# EAGLE design RTI-Dome-Shutter-RP2040 (EAGLE 9.6.2)
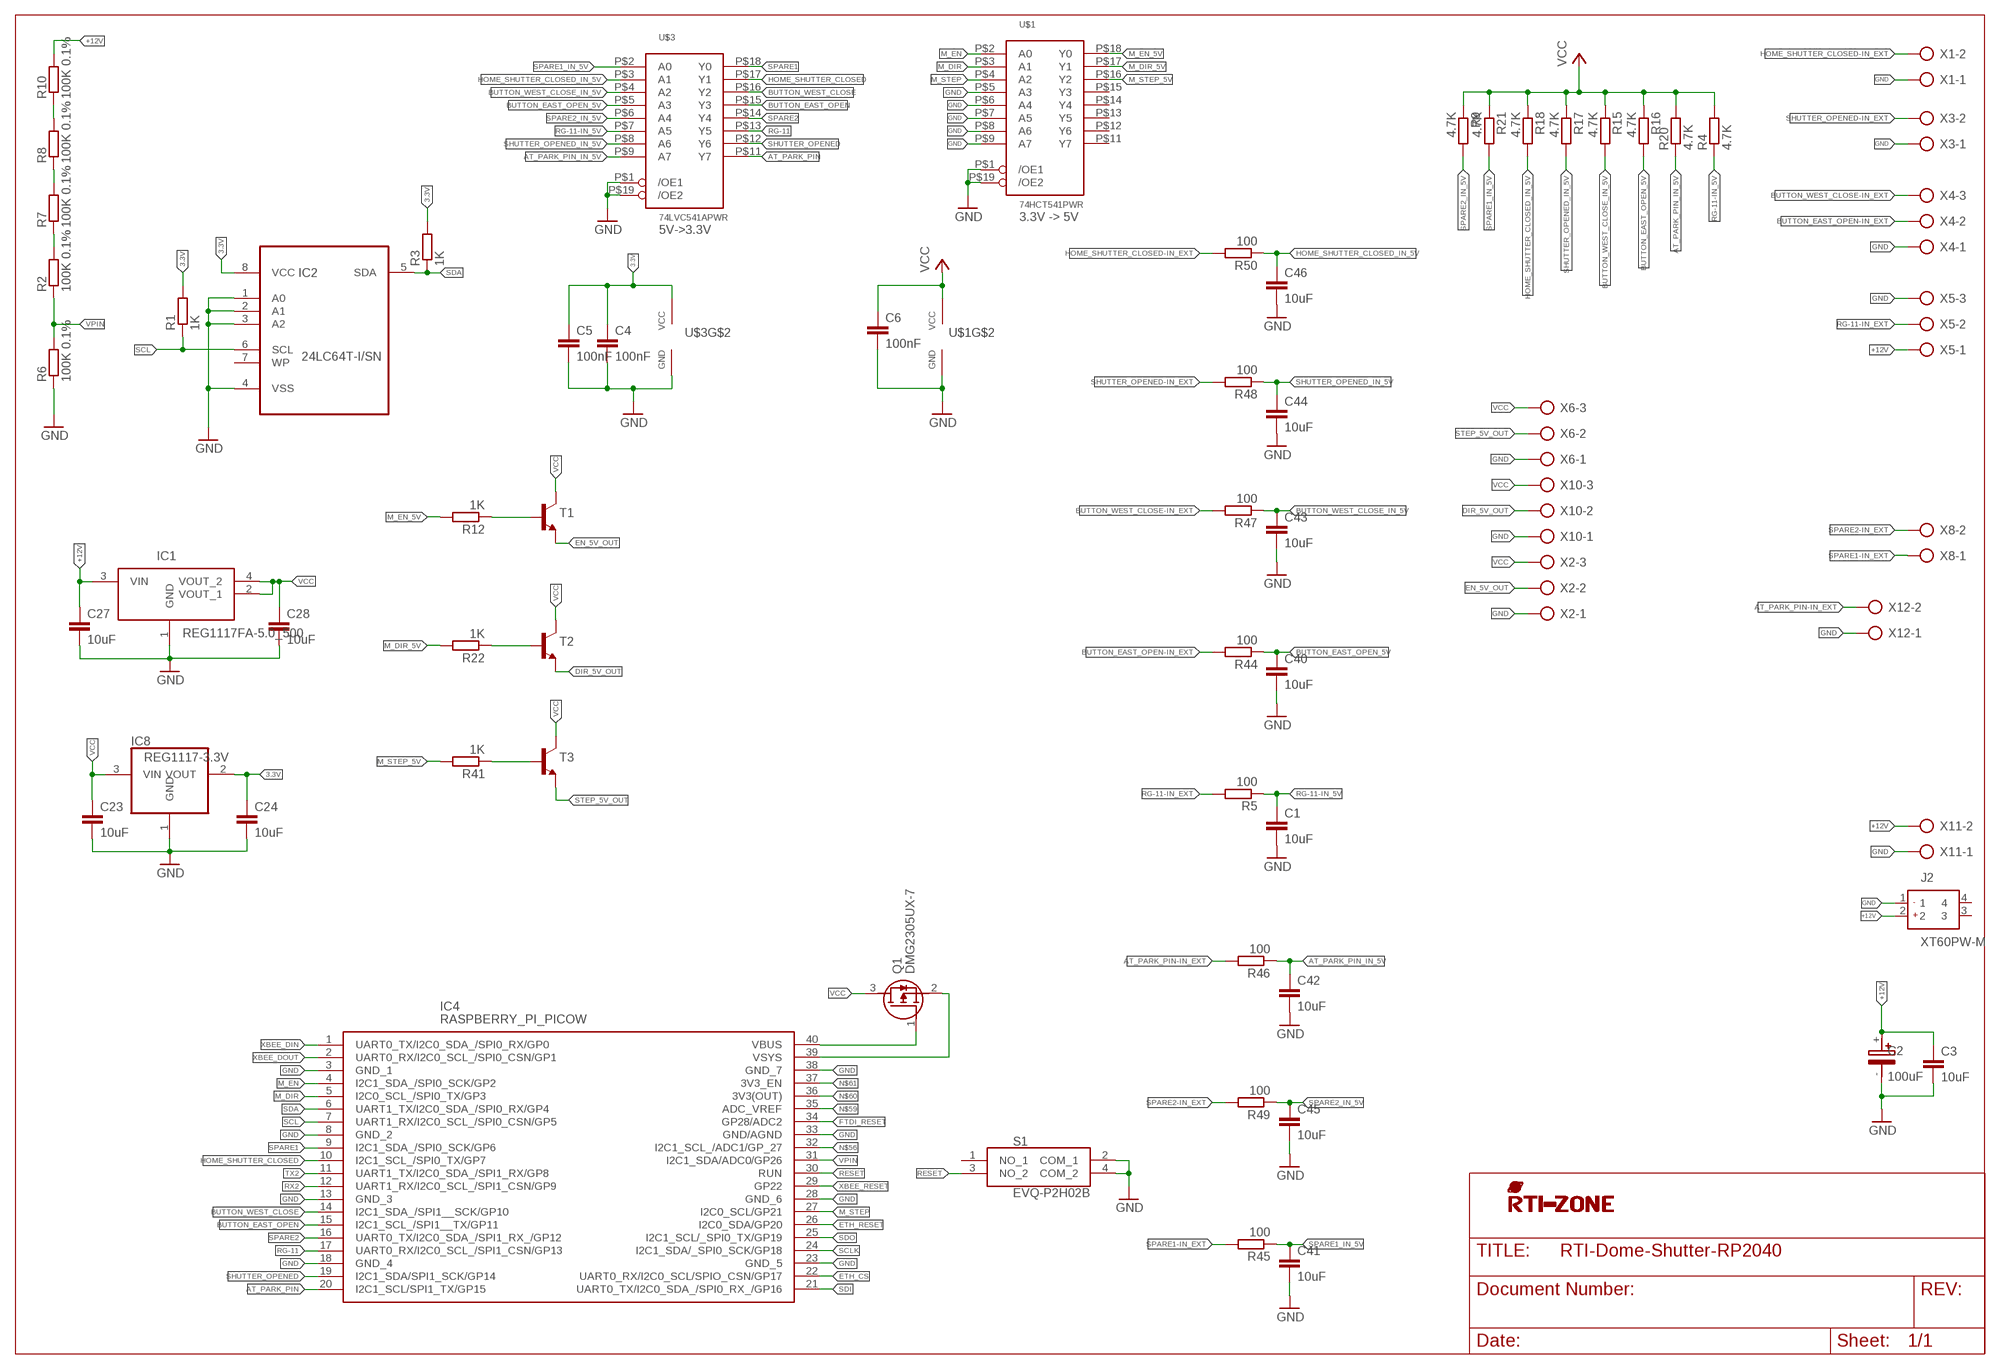
[diagram p0: schematic, sheet 1]

## Parts
C1  10uF  C-EU'0603'  [C0603]
C2  100uF  MAL215099804E3""  [UD-10X10_NICHICON]
C3  10uF  C-EU'0603'  [C0603]
C4  100nF  C-EU'0603'  [C0603]
C5  100nF  C-EU'0603'  [C0603]
C6  100nF  C-EU'0603'  [C0603]
C23  10uF  C-EU'0603'  [C0603]
C24  10uF  C-EU'0603'  [C0603]
C27  10uF  C-EU'0603'  [C0603]
C28  10uF  C-EU'0603'  [C0603]
C40  10uF  C-EU'0603'  [C0603]
C41  10uF  C-EU'0603'  [C0603]
C42  10uF  C-EU'0603'  [C0603]
C43  10uF  C-EU'0603'  [C0603]
C44  10uF  C-EU'0603'  [C0603]
C45  10uF  C-EU'0603'  [C0603]
C46  10uF  C-EU'0603'  [C0603]
IC1  REG1117FA-5.0_500  [REG1117FA50500]
IC2  24LC64T-I/SN  [SOIC127P600X175-8N]
IC4  RASPBERRY_PI_PICOW  [RASPBERRYPIPICO-W]
IC8  REG1117-3.3V  REG1117  [SOT223]
J2  XT60PW-M  [XT60PWM]
Q1  DMG2305UX-7  [SOT96P240X115-3N]
R1  1K  R-EU'0603'  [R0603]
R2  100K 0.1%  R-EU'0603'  [R0603]
R3  1K  R-EU'0603'  [R0603]
R4  4.7K  R-EU'0603'  [R0603]
R5  100  R-EU'0603'  [R0603]
R6  100K 0.1%  R-EU'0603'  [R0603]
R7  100K 0.1%  R-EU'0603'  [R0603]
R8  100K 0.1%  R-EU'0603'  [R0603]
R9  4.7K  R-EU'0603'  [R0603]
R10  100K 0.1%  R-EU'0603'  [R0603]
R12  1K  R-EU'0603'  [R0603]
R15  4.7K  R-EU'0603'  [R0603]
R16  4.7K  R-EU'0603'  [R0603]
R17  4.7K  R-EU'0603'  [R0603]
R18  4.7K  R-EU'0603'  [R0603]
R20  4.7K  R-EU'0603'  [R0603]
R21  4.7K  R-EU'0603'  [R0603]
R22  1K  R-EU'0603'  [R0603]
R41  1K  R-EU'0603'  [R0603]
R44  100  R-EU'0603'  [R0603]
R45  100  R-EU'0603'  [R0603]
R46  100  R-EU'0603'  [R0603]
R47  100  R-EU'0603'  [R0603]
R48  100  R-EU'0603'  [R0603]
R49  100  R-EU'0603'  [R0603]
R50  100  R-EU'0603'  [R0603]
S1  EVQ-P2H02B  [EVQP2H02B]
T1  MMBT3904LT1-NPN-SOT23-BEC  [SOT23-BEC]
T2  MMBT3904LT1-NPN-SOT23-BEC  [SOT23-BEC]
T3  MMBT3904LT1-NPN-SOT23-BEC  [SOT23-BEC]
U$1  74HCT541PWR  74541B  [TSSOP20]
U$3  74LVC541APWR  74541B  [TSSOP20]
U$4  RTI-LOGO_BIG  [LOGO_BIG]
X1  AK500/2  [AK500/2]
X2  AK500/3  [AK500/3]
X3  AK500/2  [AK500/2]
X4  AK500/3  [AK500/3]
X5  AK500/3  [AK500/3]
X6  AK500/3  [AK500/3]
X8  AK500/2  [AK500/2]
X10  AK500/3  [AK500/3]
X11  AK500/2  [AK500/2]
X12  AK500/2  [AK500/2]

## Nets
3.3V: C4.1 C5.1 C24.1 IC2.8(VCC) IC8.2(VOUT) R1.2 R3.2 U$3.P$20(VCC)
+12V [+12V]: C2.+ C3.1 C27.1 IC1.3(VIN) J2.2 R10.2 X5.1 X11.2
AT_PARK_PIN: IC4.20(I2C1_SCL/SPI1_TX/GP15) U$3.P$11(Y7)
AT_PARK_PIN-IN_EXT: R46.2 X12.2
AT_PARK_PIN_IN_5V: C42.1 R20.1 R46.1 U$3.P$9(A7)
BUTTON_EAST_OPEN: IC4.15(I2C1_SCL_/SPI1__TX/GP11) U$3.P$15(Y3)
BUTTON_EAST_OPEN-IN_EXT: R44.2 X4.2
BUTTON_EAST_OPEN_5V: C40.1 R16.2 R44.1 U$3.P$5(A3)
BUTTON_WEST_CLOSE: IC4.14(I2C1_SDA_/SPI1__SCK/GP10) U$3.P$16(Y2)
BUTTON_WEST_CLOSE-IN_EXT: R47.2 X4.3
BUTTON_WEST_CLOSE_IN_5V: C43.1 R15.2 R47.1 U$3.P$4(A2)
DIR-5V_TR: R22.1 T2.B
DIR_5V_OUT: T2.E X10.2
EN-5V_TR: R12.1 T1.B
EN_5V_OUT: T1.E X2.2
ETH_CS: IC4.22(UART0_RX/I2C0_SCL/SPIO_CSN/GP17)
ETH_RESET: IC4.26(I2C0_SDA/GP20)
FTDI_RESET: IC4.34(GP28/ADC2)
GND [GND]: C1.2 C2.- C3.2 C4.2 C5.2 C6.2 C23.2 C24.2 C27.2 C28.2 C40.2 C41.2 C42.2 C43.2 C44.2 C45.2 C46.2 IC1.1(GND) IC2.1(A0) IC2.2(A1) IC2.3(A2) IC2.4(VSS) IC4.3(GND_1) IC4.8(GND_2) IC4.13(GND_3) IC4.18(GND_4) IC4.23(GND_5) IC4.28(GND_6) IC4.33(GND/AGND) IC4.38(GND_7) IC8.1(GND) J2.1 R6.1 S1.2(COM_1) S1.4(COM_2) U$1.P$1(/OE1) U$1.P$5(A3) U$1.P$6(A4) U$1.P$7(A5) U$1.P$8(A6) U$1.P$9(A7) U$1.P$10(GND) U$1.P$19(/OE2) U$3.P$1(/OE1) U$3.P$10(GND) U$3.P$19(/OE2) X1.1 X2.1 X3.1 X4.1 X5.3 X6.1 X10.1 X11.1 X12.1
HOME_SHUTTER_CLOSED: IC4.10(I2C1_SCL_/SPI0_TX/GP7) U$3.P$17(Y1)
HOME_SHUTTER_CLOSED-IN_EXT: R50.2 X1.2
HOME_SHUTTER_CLOSED_IN_5V: C46.1 R18.2 R50.1 U$3.P$3(A1)
M_DIR: IC4.5(I2C0_SCL_/SPI0_TX/GP3) U$1.P$3(A1)
M_DIR_5V: R22.2 U$1.P$17(Y1)
M_EN: IC4.4(I2C1_SDA_/SPI0_SCK/GP2) U$1.P$2(A0)
M_EN_5V: R12.2 U$1.P$18(Y0)
M_STEP: IC4.27(I2C0_SCL/GP21) U$1.P$4(A2)
M_STEP_5V: R41.2 U$1.P$16(Y2)
N$2: R7.2 R8.1
N$3: R8.2 R10.1
N$5: R2.2 R7.1
N$56: IC4.32(I2C1_SCL_/ADC1/GP_27)
N$59: IC4.35(ADC_VREF)
N$60: IC4.36(3V3(OUT))
N$61: IC4.37(3V3_EN)
RESET: IC4.30(RUN) S1.3(NO_2)
RG-11: IC4.17(UART0_RX/I2C0_SCL_/SPI1_CSN/GP13) U$3.P$13(Y5)
RG-11-IN_5V: C1.1 R4.1 R5.1 U$3.P$7(A5)
RG-11-IN_EXT: R5.2 X5.2
RX2: IC4.12(UART1_RX/I2C0_SCL_/SPI1_CSN/GP9)
SCL: IC2.6(SCL) IC4.7(UART1_RX/I2C0_SCL_/SPI0_CSN/GP5) R1.1
SCLK: IC4.24(I2C1_SDA/_SPI0_SCK/GP18)
SDA: IC2.5(SDA) IC4.6(UART1_TX/I2C0_SDA_/SPI0_RX/GP4) R3.1
SDI: IC4.21(UART0_TX/I2C0_SDA_/SPI0_RX_/GP16)
SDO: IC4.25(I2C1_SCL/_SPI0_TX/GP19)
SHUTTER_OPENED: IC4.19(I2C1_SDA/SPI1_SCK/GP14) U$3.P$12(Y6)
SHUTTER_OPENED-IN_EXT: R48.2 X3.2
SHUTTER_OPENED_IN_5V: C44.1 R17.2 R48.1 U$3.P$8(A6)
SPARE1: IC4.9(I2C1_SDA_/SPI0_SCK/GP6) U$3.P$18(Y0)
SPARE1-IN_EXT: R45.2 X8.1
SPARE1_IN_5V: C41.1 R21.2 R45.1 U$3.P$2(A0)
SPARE2: IC4.16(UART0_TX/I2C0_SDA_/SPI1_RX_/GP12) U$3.P$14(Y4)
SPARE2-IN_EXT [GND]: R49.2 X8.2
SPARE2_IN_5V [GND]: C45.1 R9.2 R49.1 U$3.P$6(A4)
STEP-5V_TR: R41.1 T3.B
STEP_5V_OUT: T3.E X6.2
TX2: IC4.11(UART1_TX/I2C0_SDA_/SPI1_RX/GP8)
VBUS: IC4.40(VBUS) Q1.1(G)
VCC: C6.1 C23.1 C28.1 IC1.2(VOUT_1) IC1.4(VOUT_2) IC8.3(VIN) Q1.3(D) R4.2 R9.1 R15.1 R16.1 R17.1 R18.1 R20.2 R21.1 T1.C T2.C T3.C U$1.P$20(VCC) X2.3 X6.3 X10.3
VPIN: IC4.31(I2C1_SDA/ADC0/GP26) R2.1 R6.2
VSYS: IC4.39(VSYS) Q1.2(S)
XBEE_DIN: IC4.1(UART0_TX/I2C0_SDA_/SPI0_RX/GP0)
XBEE_DOUT: IC4.2(UART0_RX/I2C0_SCL_/SPI0_CSN/GP1)
XBEE_RESET: IC4.29(GP22)
Unconnected: IC2.7(WP) J2.3 J2.4 S1.1(NO_1) U$1.P$11(Y7) U$1.P$12(Y6) U$1.P$13(Y5) U$1.P$14(Y4) U$1.P$15(Y3)

## Notes on the sheet
- 3.3V -> 5V
- 5V->3.3V

## Library data of the parts
C1 C3 C23 C24 C27 C28 C40-C46 = rti:C-EU; MPN: CC0805KKX5R8BB106
C2 = samacsys:MAL215099804E3: Aluminum Electrolytic Capacitors - SMD 100uF 63V 20% Source: Datasheet <https://www.vishay.com/docs/28395/150crz.pdf>; MPN: MAL215099804E3
C4-C6 = rti:C-EU; MPN: 0805YD104KAT2A
IC1 = REG1117FA-5.0_500:REG1117FA-5.0_500: 800mA and 1A Low Dropout Positive Regulator 1.8V, 2.5V, 2.85, 3.3V, 5V, and Adjustable Source: Datasheet <https://www.ti.com/lit/ds/symlink/reg1117a.pdf?ts=1712806080445>; ARROW_PART_NUMBER: REG1117FA-5.0/500; ARROW_PRICE-STOCK: https://www.arrow.com/en/products/reg1117fa-5.0500/texas-instruments?region=nac; DESCRIPTION: 800mA and 1A Low Dropout Positive Regulator 1.8V, 2.5V, 2.85, 3.3V, 5V, and Adjustable; HEIGHT: 5.08mm; MANUFACTURER_NAME: Texas Instruments; MANUFACTURER_PART_NUMBER: REG1117FA-5.0/500; MOUSER_PART_NUMBER: 595-REG1117FA50/500; MOUSER_PRICE-STOCK: https://www.mouser.co.uk/ProductDetail/Texas-Instruments/REG1117FA-5.0-500?qs=PVVDbbWpW3KD0gSKmem36g%3D%3D
IC2 = rti:24LC64T-I/SN: 64K I2C Serial EEPROM; MPN: 24LC64T-I/SN; OC_FARNELL: 1296583; OC_NEWARK: 12C2021; PACKAGE: SOIC-8; SUPPLIER: MICROCHIP
IC4 = samacsys:RASPBERRY_PI_PICO: RASPBERRY-PI - RASPBERRY PI PICO W - Raspberry Pi Board, Raspberry Pi Pico W, RP2040, 32bit, ARM Cortex-M0+ Source: Datasheet <https://datasheets.raspberrypi.com/picow/pico-w-datasheet.pdf>
IC8 = burr-brown:REG1117: 800mA and 1A Low Dropout (LDO) Positive Regulator 1.8V, 2.5V, 2.85V, 3.3V, 5V, and Adj; MPN: REG1117-3.3/2K5; OC_FARNELL: 1097566; OC_NEWARK: 14P6981
J2 = samacsys:XT60PW-M: Socket; DC supply; XT60; male; PIN: 2; on PCBs; THT; Colour: yellow Source: Datasheet <https://www.tme.eu/Document/9b8d0c5eb7094295f3d3112c214d3ade/XT60PW SPEC.pdf>; DESCRIPTION: Socket; DC supply; XT60; male; PIN: 2; on PCBs; THT; Colour: yellow; HEIGHT: 8.4mm; MANUFACTURER_NAME: Changzou Amass Elec; MANUFACTURER_PART_NUMBER: XT60PW-M; MPN: XT60PW-M
Q1 = samacsys:DMG2305UX-7: MOSFET P-Ch 20V 5A Enhancement SOT23 Diodes Inc DMG2305UX-7 P-channel MOSFET Transistor, -3.3 A, -20 V, 3-Pin SOT-23 Source: Datasheet <https://www.diodes.com//assets/Datasheets/DMG2305UX.pdf>; ARROW_PART_NUMBER: DMG2305UX-7; ARROW_PRICE-STOCK: https://www.arrow.com/en/products/dmg2305ux-7/diodes-incorporated?region=nac; DESCRIPTION: MOSFET P-Ch 20V 5A Enhancement SOT23 Diodes Inc DMG2305UX-7 P-channel MOSFET Transistor, -3.3 A, -20 V, 3-Pin SOT-23; HEIGHT: 1.15mm; MANUFACTURER_NAME: Diodes Incorporated; MANUFACTURER_PART_NUMBER: DMG2305UX-7; MOUSER_PART_NUMBER: 621-DMG2305UX-7; MOUSER_PRICE-STOCK: https://www.mouser.co.uk/ProductDetail/Diodes-Incorporated/DMG2305UX-7?qs=L1DZKBg7t5F%2FNBHrjfxC%252Bg%3D%3D
R1 R3 = rti:R-EU; MPN: RT0805FRE071KL
R2 R6-R8 R10 = rti:R-EU; MPN: AT0805BRD07100KL
R4 R9 R12 R15-R18 R20-R22 R41 = rti:R-EU; MPN: RT0805FRE074K7L
R5 R44-R50 = rti:R-EU; MPN: RT0805FRD07100RL
S1 = samacsys:EVQ-P2H02B: Tactile Switches 2.5NF 4.7x3.5x2.5mm Source: Datasheet <https://www.mouser.com/datasheet/2/315/sw_lt_eng_4735s-1288983.pdf>; ARROW_PART_NUMBER: EVQ-P2H02B; ARROW_PRICE-STOCK: https://www.arrow.com/en/products/evq-p2h02b/panasonic?region=nac; DESCRIPTION: Tactile Switches 2.5NF 4.7x3.5x2.5mm; HEIGHT: 2.7mm; MANUFACTURER_NAME: Panasonic; MANUFACTURER_PART_NUMBER: EVQ-P2H02B; MOUSER_PART_NUMBER: 667-EVQ-P2H02B; MOUSER_PRICE-STOCK: https://www.mouser.co.uk/ProductDetail/Panasonic/EVQ-P2H02B?qs=WwqriLBepZtQ2aXTL4JXCg%3D%3D
T1-T3 = transistor:*-NPN-: NPN Transistror BF959 corrected 2008.03.06
U$1 U$3 = rti:74*541: Octal non inverting buffer
U$4 = rti:RTI-LOGO
X1 X3 X8 X11 X12 = rti:AK500/2: CONNECTOR; MPN: 691101710002; OC_FARNELL: unknown; OC_NEWARK: unknown
X2 X6 X10 = rti:AK500/3: CONNECTOR; OC_FARNELL: unknown; OC_NEWARK: unknown
X4 X5 = rti:AK500/3: CONNECTOR; MPN: 691101710003; OC_FARNELL: unknown; OC_NEWARK: unknown

## Net classes
0 default: width 0.254 mm, drill 0.3 mm, clearance 0.152 mm
1 +12V: width 0.254 mm, drill 0.3 mm, clearance 0.152 mm
2 GND: width 0.254 mm, drill 0.3 mm, clearance 0.152 mm
3 +3V3: width 0.254 mm, drill 0.254 mm, clearance 0.152 mm
4 diff: width 0.254 mm, drill 0.254 mm, clearance 0.152 mm

## Board
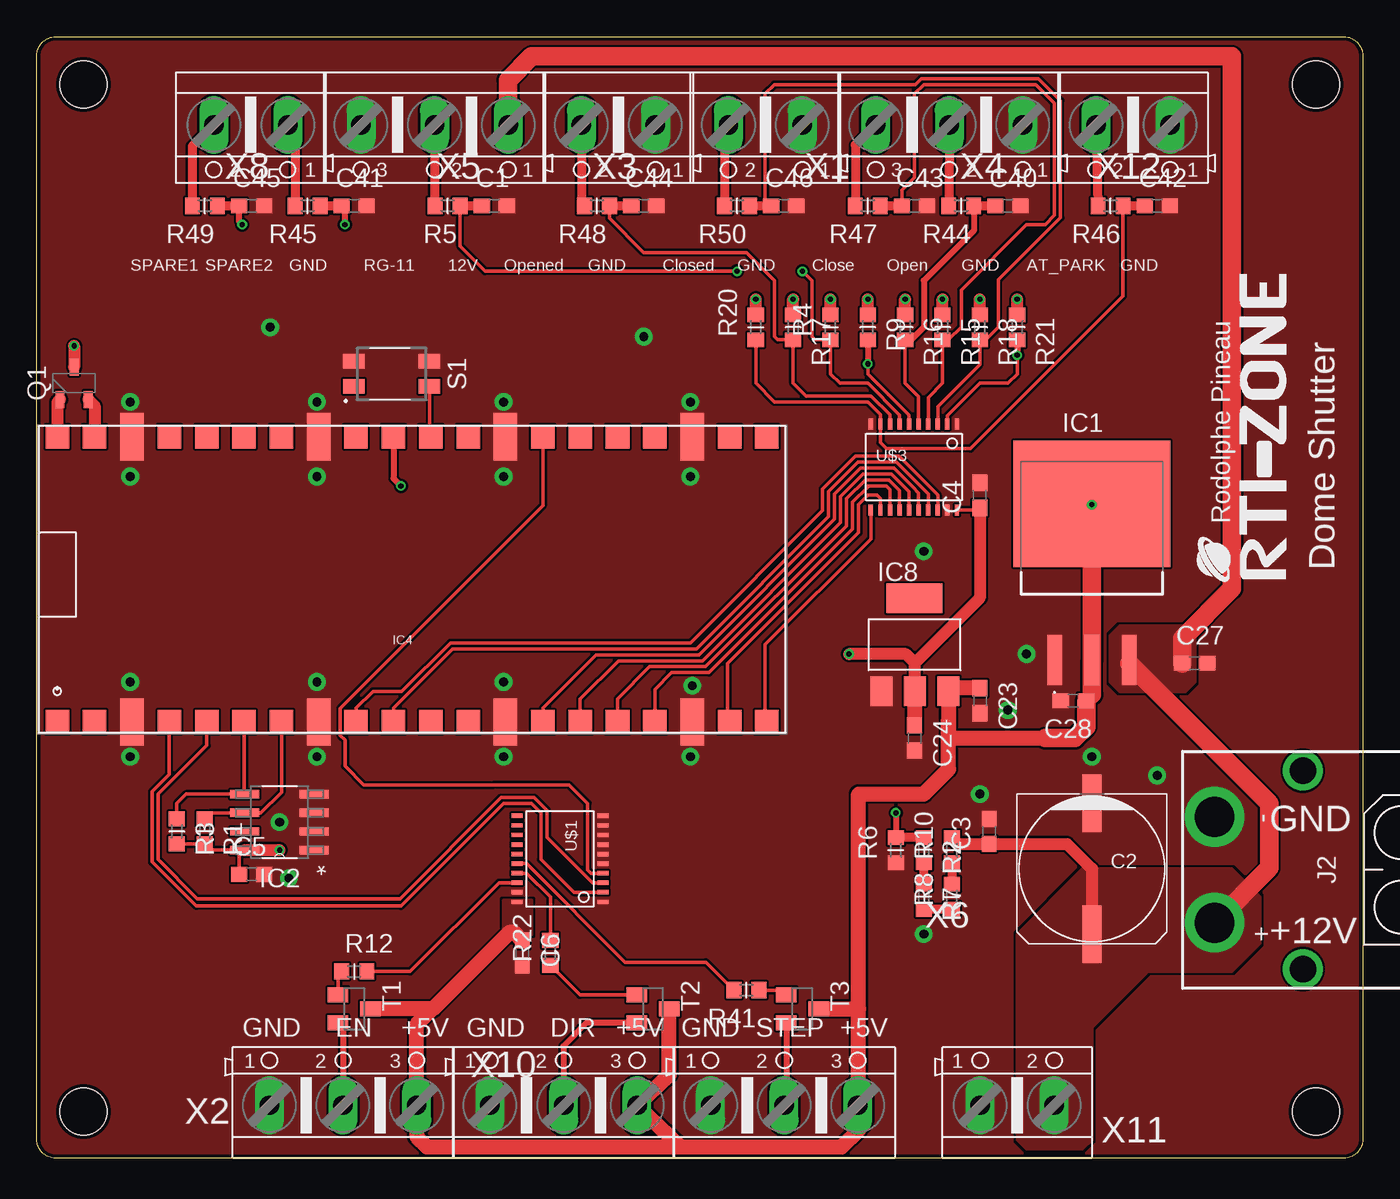
[diagram p1: board, top side]
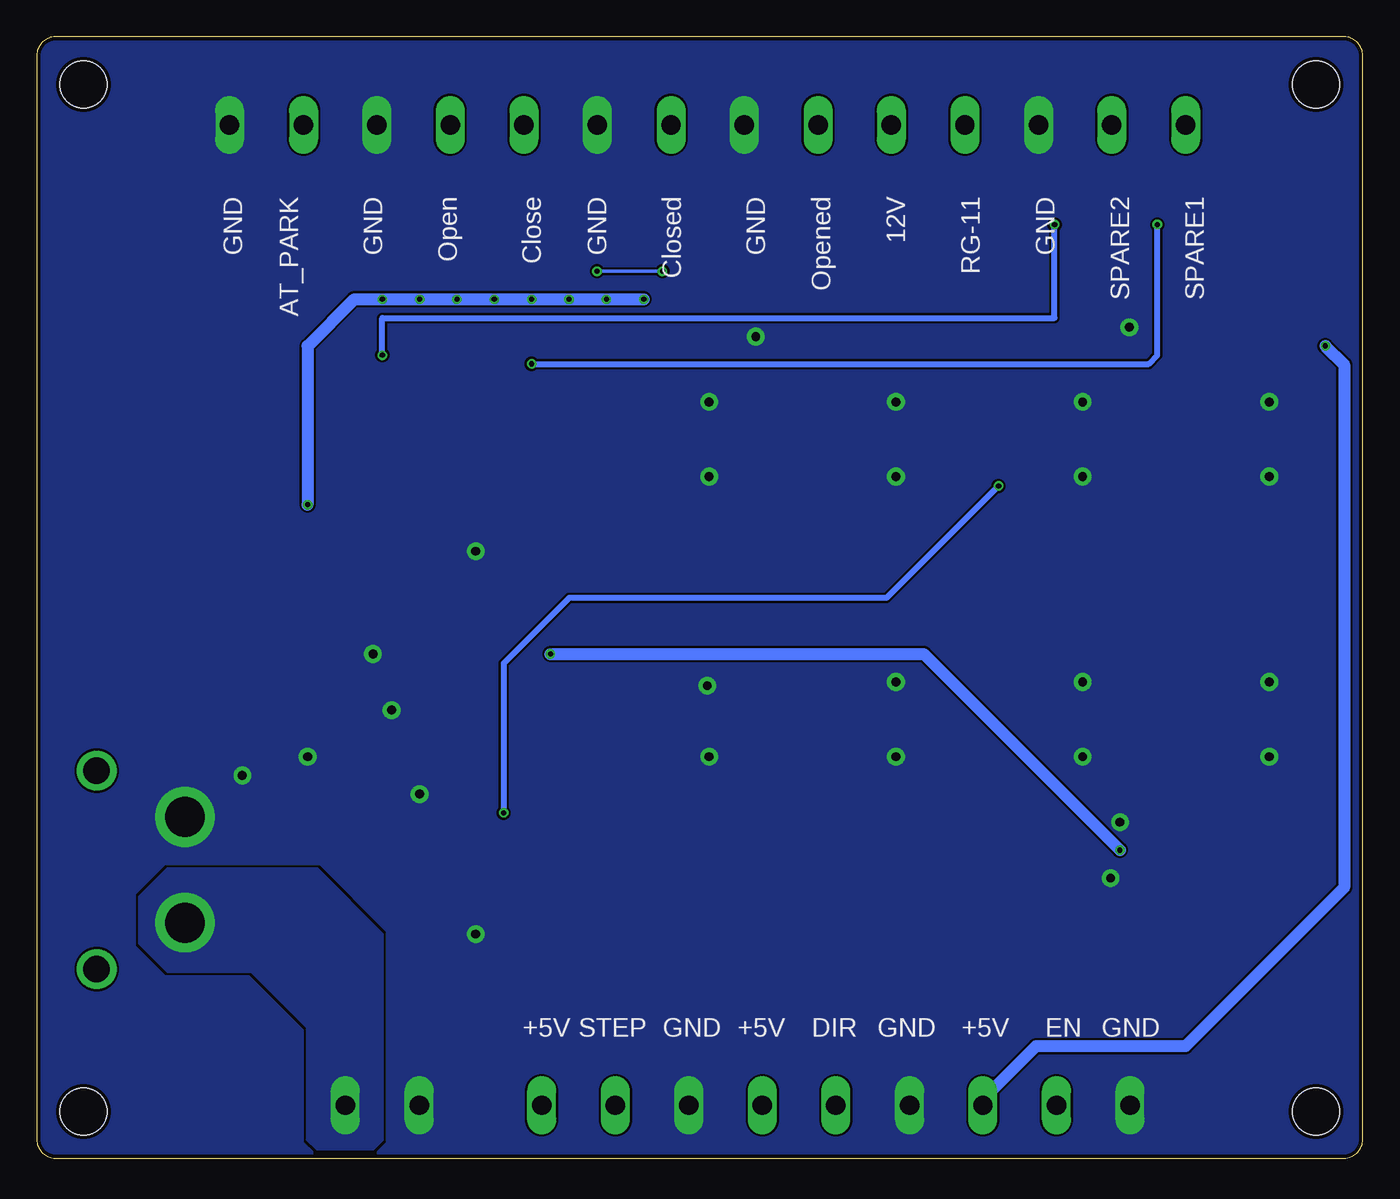
[diagram p2: board, bottom side, seen from below]

Size 90.17 x 76.27 mm. Coordinates in mm from the lower left corner, seen from the top.
Outline: 0,75.01 arc-90 1.26,76.27 88.92,76.27 arc-90 90.17,75.01 90.17,1.26 arc-90 88.92,0 1.26,0 arc-90 0,1.26 0,75.01
Copper layers (1*16): Top 0.089mm / dielectric 1.442mm / Bottom 0.089mm
Design rules "jlcpcb2layer *": minimum track width 5mil, minimum drill 0.2mm, track to track 5mil, track to pad 5mil, pad to pad 5mil, via to via 5mil, smd to smd 5mil, copper to edge 10mil, drill to drill 0.5mm, minimum pad ring 6mil, minimum via ring 6mil, stop-mask expansion 0.05mm, vias tented up to drill 130mil, thermal gap 8mil
Holes 3.2 mm at 87,73.03 87,3.17 3.17,3.17 3.17,73.03

### Footprints (pad centres in the part's own frame; a part is rotated, then mirrored left to right if it is on the bottom)
C0603 = smd 1.1 x 1: 1 -0.85,0; 2 0.85,0
UD-10X10_NICHICON = smd 3.9 x 1.3: + 4.433,0; - -4.458,0
REG1117FA50500 = smd 1 x 3.4: 1 -2.54,-6.745; 2 0,-6.745; 3 2.54,-6.745 | smd 10.7 x 8.6: 4 0,3.855
SOIC127P600X175-8N = smd 1.981 x 0.559: 1 -2.362,1.905; 2 -2.362,0.635; 3 -2.362,-0.635; 4 -2.362,-1.905; 5 2.362,-1.905; 6 2.362,-0.635; 7 2.362,0.635; 8 2.362,1.905
RASPBERRYPIPICO-W = smd 1.6 x 1.6: 1 -9.69,24.13; 2 -9.69,21.59; 4 -9.69,16.51; 5 -9.69,13.97; 6 -9.69,11.43; 7 -9.69,8.89; 9 -9.69,3.81; 10 -9.69,1.27; 11 -9.69,-1.27; 12 -9.69,-3.81; 14 -9.69,-8.89; 15 -9.69,-11.43; 16 -9.69,-13.97; 17 -9.69,-16.51; 19 -9.69,-21.59; 20 -9.69,-24.13; 21 9.69,-24.13; 22 9.69,-21.59; 24 9.69,-16.51; 25 9.69,-13.97; 26 9.69,-11.43; 27 9.69,-8.89; 29 9.69,-3.81; 30 9.69,-1.27; 31 9.69,1.27; 32 9.69,3.81; 34 9.69,8.89; 35 9.69,11.43; 36 9.69,13.97; 37 9.69,16.51; 39 9.69,21.59; 40 9.69,24.13 | smd 3.2 x 1.6: 3 -9.69,19.05; 8 -9.69,6.35; 13 -9.69,-6.35; 18 -9.69,-19.05; 23 9.69,-19.05; 28 9.69,-6.35; 33 9.69,6.35; 38 9.69,19.05
SOT223 = smd 1.499 x 2.007: 1 -2.261,-3.15; 2 0.025,-3.15; 3 2.311,-3.15 | smd 3.81 x 2.007: 4 0,3.15
XT60PWM = drill 2.7 pad 4.05: 1 -3.6,0; 2 3.6,0 | drill 1.8 pad 2.7: 3 6.75,6; 4 -6.75,6
SOT96P240X115-3N = smd 1.15 x 0.6: 1 -1.1,0.96; 2 -1.1,-0.96; 3 1.1,0
R0603 = smd 1 x 1.1: 1 -0.85,0; 2 0.85,0
EVQP2H02B = smd 1 x 1.45: 1 -0.85,2.575; 2 0.85,2.575; 3 -0.85,-2.575; 4 0.85,-2.575
SOT23-BEC = smd 1 x 1.4: B -0.95,-1.1; C 0,1.1; E 0.95,-1.1
TSSOP20 = smd 0.75 x 0.3: P$1 -2.94,2.885; P$2 -2.94,2.235; P$3 -2.94,1.585; P$4 -2.94,0.935; P$5 -2.94,0.285; P$6 -2.94,-0.365; P$7 -2.94,-1.015; P$8 -2.94,-1.665; P$9 -2.94,-2.315; P$10 -2.94,-2.965; P$11 2.91,-2.965; P$12 2.91,-2.315; P$13 2.91,-1.665; P$14 2.91,-1.015; P$15 2.91,-0.365; P$16 2.91,0.285; P$17 2.91,0.935; P$18 2.91,1.585; P$19 2.91,2.235; P$20 2.91,2.885
AK500/2 = drill 1.321 long: 1 -2.515,0; 2 2.515,0
AK500/3 = drill 1.321 long: 1 -5.004,0; 2 0,0; 3 5.004,0

### Placement (x,y rotation side)
C1  31.11,64.77 0 top
C2  71.75,19.68 270 top
C3  64.77,22.23 90 top
C4  64.14,45.09 90 top
C5  14.61,19.3 0 top
C6  33.02,13.97 270 top
C23  64.14,31.11 270 top
C24  59.69,28.57 270 top
C27  78.74,33.66 0 top
C28  70.48,31.11 180 top
C40  66.04,64.77 0 top
C41  21.59,64.77 0 top
C42  76.2,64.77 0 top
C43  59.69,64.77 0 top
C44  41.27,64.77 0 top
C45  14.61,64.77 0 top
C46  50.8,64.77 0 top
IC1  71.75,40.64 0 top
IC2  16.51,22.86 180 top
IC4  25.53,39.37 90 top
IC8  59.69,34.92 0 top
J2  80.1,19.61 270 top
Q1  2.54,52.7 90 top
R1  11.43,22.23 270 top
R2  60.33,20.95 270 top
R3  9.53,22.23 270 top
R4  53.98,56.52 90 top
R5  27.94,64.77 180 top
R6  58.42,20.95 90 top
R7  60.33,17.78 270 top
R8  62.23,17.78 90 top
R9  56.52,56.52 270 top
R10  62.23,20.95 90 top
R12  21.59,12.7 0 top
R15  61.59,56.52 270 top
R16  59.05,56.52 270 top
R17  51.44,56.52 270 top
R18  64.14,56.52 270 top
R20  48.9,56.52 90 top
R21  66.67,56.52 270 top
R22  34.92,13.97 90 top
R41  48.26,11.43 180 top
R44  62.87,64.77 180 top
R45  18.41,64.77 180 top
R46  73.03,64.77 180 top
R47  56.52,64.77 180 top
R48  38.1,64.77 180 top
R49  11.43,64.77 180 top
R50  47.62,64.77 180 top
S1  24.13,53.34 90 top
T1  21.59,10.16 270 top
T2  41.91,10.16 270 top
T3  52.07,10.16 270 top
U$1  35.56,20.32 180 top
U$3  59.69,46.99 270 top
U$4  84.96,39.37 90 top
X1  49.55,70.28 180 top
X2  20.83,3.6 0 top
X3  39.55,70.28 180 top
X4  62.05,70.28 180 top
X5  27.05,70.28 180 top
X6  50.83,3.6 0 top
X8  14.55,70.28 180 top
X10  35.83,3.6 0 top
X11  66.67,3.6 0 top
X12  74.56,70.28 180 top

### Tracks (layer width: path | path; a pad name or v marks a point on that pad's centre or on a via)
3.3V  (via drill 0.35)
  Top 0.254: C4.1 63.98,44.08 U$3.P$20 | R3.2 R1.2 11.85,20.95 IC2.8 13.76,20.56 C5.1
  Top 0.813: IC8.2 59.72,33.68 | C4.1 64.14,38.1 61.59,35.56 59.72,33.68 | IC2.8 v16.51,20.95 | 59.72,33.68 59.11,34.29 v55.24,34.29
  Top 1.016: IC8.2 59.69,31.75 C24.1
  Bottom 0.813: v16.51,20.95 29.84,34.29 v55.24,34.29
+12V
  Top 0.813: R10.2 62.66,21.38 C3.1 70.06,21.38 71.75,19.68 C2.+
  Top 1.27: X5.1 32.05,73.32 33.66,74.93 81.28,74.93 81.28,38.73 77.89,35.34 C27.1 | J2.2 83.82,19.73 83.82,24.13 74.3,33.66
  pour Top (no thermals): 66.67,15.24 71.12,19.68 81.28,19.68 83.19,17.78 83.19,14.61 81.28,12.7 75.56,12.7 71.75,8.89 71.75,1.27 71.12,0.64 67.31,0.64 66.67,1.27
  pour Bottom (no thermals): 66.67,1.27 66.67,15.24 71.12,19.68 81.28,19.68 83.19,17.78 83.19,14.61 81.28,12.7 75.56,12.7 71.75,8.89 71.75,1.27 71.12,0.64 67.31,0.64
  pour Top (no thermals): 73.03,35.56 73.66,36.2 77.47,36.2 78.11,36.2 78.74,35.56 78.74,32.38 78.11,31.75 73.66,31.75 73.03,32.38
AT_PARK_PIN
  Top 0.254: U$3.P$11 56.73,42.12 49.53,34.92 49.53,29.81 IC4.20
AT_PARK_PIN-IN_EXT
  Top 0.61: X12.2 72.16,64.78 R46.2
AT_PARK_PIN_IN_5V
  Top 0.254: R20.1 48.9,52.7 50.16,51.44 56.52,51.44 57.15,50.8 57.38,50.58 U$3.P$9 57.38,48.67 57.78,48.26 63.5,48.26 73.88,58.63 R46.1
  Top 0.61: R46.1 C42.1
BUTTON_EAST_OPEN
  Top 0.254: IC4.15 36.96,31.24 39.55,33.83 45.26,33.83 54.66,43.23 54.66,45.02 56.18,46.53 58.12,46.53 58.99,45.66 59.33,45.33 U$3.P$15
BUTTON_EAST_OPEN-IN_EXT
  Top 0.61: X4.2 62.05,64.8 R44.2
BUTTON_EAST_OPEN_5V
  Top 0.254: U$3.P$5 59.98,51.78 59.05,52.7 R16.2
  Top 0.406: R44.1 63.72,63.08 60.33,59.69 60.33,56.52 59.48,55.66 R16.2
  Top 0.61: R44.1 C40.1
BUTTON_WEST_CLOSE
  Top 0.254: IC4.14 34.42,30.61 38.05,34.24 45.03,34.24 54.25,43.46 54.25,45.18 56.01,46.94 58.29,46.94 59.6,45.63 59.98,45.25 U$3.P$16
BUTTON_WEST_CLOSE-IN_EXT
  Top 0.61: X4.3 55.66,68.9 R47.2
BUTTON_WEST_CLOSE_IN_5V
  Top 0.254: U$3.P$4 60.62,51.73 61.59,52.7 R15.2 62.02,55.66 62.87,56.52 62.87,59.05 67.31,63.5 68.58,63.5 69.22,64.14 69.22,71.75 67.94,73.03 60.33,73.03 59.69,72.39 59.69,66.67 58.84,65.83 C43.1
  Top 0.61: R47.1 C43.1
DIR-5V_TR
  Top 0.254: T2.B 36.94,11.11 R22.1
DIR_5V_OUT
  Top 0.406: T2.E 37.4,9.21 35.81,7.62 35.81,3.61 X10.2
EN-5V_TR
  Top 0.254: R12.1 20.49,12.45 T1.B
EN_5V_OUT
  Top 0.406: T1.E 20.83,8.87 X2.2
GND  (via drill 0.6 pad 1.2)
  other vias: 31.75,32.38 16.51,22.86 44.45,46.35 31.75,46.35 19.05,46.35 6.35,46.35 6.35,32.38 19.05,32.38 31.75,27.3 44.45,27.3 67.31,34.29 64.14,24.77 60.33,15.24 41.27,55.88 15.88,56.52 71.75,27.3 76.2,26.04 66.04,30.48 60.33,41.27 17.14,19.05 6.35,27.3 19.05,27.3 44.58,32.13 6.35,51.44 19.05,51.44 31.75,51.44 44.45,51.44
  pour Bottom (isolate 0.122, rank 2, no thermals): 0,0 0,76.2 90.17,76.2 90.17,0
  pour Top (isolate 0.122, rank 2, no thermals): 0,0 0,76.2 90.17,76.2 90.17,0
HOME_SHUTTER_CLOSED
  Top 0.254: IC4.10 24.26,30.61 28.3,34.65 44.87,34.65 53.85,43.63 53.85,45.35 55.84,47.35 58.46,47.35 60.62,45.18 U$3.P$17
HOME_SHUTTER_CLOSED-IN_EXT
  Top 0.61: X1.2 46.77,70.02 R50.2
HOME_SHUTTER_CLOSED_IN_5V
  Top 0.254: U$3.P$3 61.27,51.12 64.14,53.98 R18.2 64.56,55.66 65.41,56.52 65.41,59.75 69.62,63.97 69.62,71.92 68.11,73.43 60.16,73.43 59.75,73.03 50.16,73.03 49.53,72.39 49.53,65.19 C46.1
  Top 0.61: R50.1 C46.1
M_DIR
  Top 0.254: U$1.P$3 37.78,18.73 34.7,21.82 34.7,23.66 33.82,24.54 31.58,24.54 24.7,17.65 10.92,17.65 8.26,20.32 8.26,24.77 11.56,28.07 IC4.5
M_DIR_5V
  Top 0.254: R22.2 34.92,17.78 33.32,19.39 U$1.P$17
M_EN
  Top 0.254: U$1.P$2 36.52,18.09 34.29,20.32 34.29,23.5 33.66,24.13 31.75,24.13 24.77,17.14 10.86,17.14 7.85,20.15 7.85,24.93 9.02,26.1 IC4.4
M_EN_5V
  Top 0.254: U$1.P$18 31.43,18.73 25.4,12.7 R12.2
M_STEP
  Top 0.254: IC4.27 34.42,44.38 20.64,30.6 20.64,28.76 20.95,28.45 20.95,26.67 22.23,25.4 31.11,25.4 36.2,25.4 37.47,24.13 37.47,19.62 37.7,19.39 U$1.P$4
M_STEP_5V
  Top 0.254: U$1.P$16 33.3,20.04 40.01,13.34 45.51,13.34 R41.2
N$2
  Top 0.61: R8.1 R7.2
N$3
  Top 0.61: R10.1 R8.2
N$5
  Top 0.61: R7.1 R2.2
RESET
  Top 0.254: S1.3 26.7,49.15 IC4.30
RG-11
  Top 0.254: U$3.P$13 58.02,45.48 57.78,45.72 56.52,45.72 56.52,45.66 55.47,44.62 55.47,42.77 45.72,33.02 43.18,33.02 42.04,31.88 IC4.17
RG-11-IN_5V  (via drill 0.35)
  Top 0.254: U$3.P$7 58.67,50.55 56.52,52.7 54.61,52.7 53.98,53.34 R4.1 52.92,55.66 52.7,55.88 52.7,59.69 v52.07,60.33 | v47.62,60.33 30.48,60.33 28.79,62.02 R5.1
  Top 0.61: R5.1 C1.1
  Bottom 0.254: v52.07,60.33 v47.62,60.33
RG-11-IN_EXT
  Top 0.61: X5.2 27.05,64.81 R5.2
SCL
  Top 0.254: R1.1 11.85,23.5 IC2.6 15.24,23.5 16.64,24.89 IC4.7
SDA
  Top 0.254: R3.1 9.53,24.13 10.16,24.77 IC2.5 14.1,24.82 IC4.6
SHUTTER_OPENED
  Top 0.254: U$3.P$12 57.38,44.86 57.15,45.09 56.52,45.09 55.88,44.45 55.88,42.55 46.99,33.66 46.99,29.81 IC4.19
SHUTTER_OPENED-IN_EXT
  Top 0.61: X3.2 37.04,64.98 R48.2
SHUTTER_OPENED_IN_5V
  Top 0.254: U$3.P$8 58.02,50.56 56.74,51.84 52.3,51.84 51.44,52.7 R17.2 50.38,55.66 50.16,55.88 50.16,59.69 48.26,61.59 41.27,61.59 38.95,63.92 R48.1
  Top 0.61: R48.1 C44.1
SPARE1
  Top 0.254: IC4.9 21.72,30.61 22.86,31.75 24.82,31.75 28.13,35.05 44.45,35.05 53.44,44.04 53.44,45.52 55.67,47.75 58.63,47.75 61.27,45.1 U$3.P$18
SPARE1-IN_EXT
  Top 0.61: X8.1 17.57,69.78 R45.2
SPARE1_IN_5V  (via drill 0.35)
  Top 0.254: U$3.P$2 61.92,50.49 64.14,52.7 66.04,52.7 66.67,53.34 v66.67,54.61
  Top 0.406: R21.2 v66.67,54.61 | v20.95,63.5 20.95,64.56 C41.1
  Top 0.61: R45.1 C41.1
  Bottom 0.406: v66.67,54.61 66.67,57.15 20.95,57.15 v20.95,63.5
SPARE2
  Top 0.254: IC4.16 39.5,31.24 41.68,33.43 45.49,33.43 55.07,43 55.07,44.85 56.35,46.13 57.95,46.13 58.67,45.41 U$3.P$14
SPARE2-IN_EXT
  Top 0.61: X8.2 10.58,68.82 R49.2
SPARE2_IN_5V  (via drill 0.35)
  Top 0.254: U$3.P$6 59.33,50.53 56.52,53.34 v56.52,54.02
  Top 0.406: R9.2 v56.52,54.02 | v56.52,54.02 56.52,53.98 v56.52,54.02 | v13.97,63.5 13.76,63.72 C45.1
  Top 0.61: R49.1 C45.1
  Bottom 0.406: v56.52,54.02 14.56,54.02 13.97,54.61 v13.97,63.5
STEP-5V_TR
  Top 0.254: R41.1 50.65,11.43 T3.B
STEP_5V_OUT
  Top 0.406: T3.E 50.97,3.74 X6.2
VBUS
  Top 0.813: Q1.1 1.4,51.42 IC4.40
VCC  (via drill 0.35)
  Top 0.813: R20.2 v48.9,58.42 | R17.1 v51.44,58.42 | R4.2 v53.98,58.42 | R9.1 v56.52,58.42 | R16.1 v59.05,58.42 | R15.1 v61.59,58.42 | R18.1 v64.14,58.42 | R21.1 v66.67,58.42 | v2.54,55.24 Q1.3 | 71.37,31.08 C28.1 71.75,31.54 | IC1.4 v71.75,44.45
  Top 1.016: C23.1 62.19,31.96 IC8.3 62,29.84 | 62,29.84 62,28.8 62.23,28.57 68.58,28.57 | T3.C 55.88,10.16 | 62,29.84 62,26.44 60.33,24.77 55.88,24.77 55.88,10.16 | X6.3 55.88,3.65 | 55.88,3.65 55.88,10.16 | T2.C 43.01,5.67 X10.3 43.78,0.76 44.45,0.76 | 44.45,0.76 54.74,0.76 55.88,1.91 55.88,3.65 | 44.45,0.76 26.54,0.76 25.83,1.47 X2.3 25.83,9.09 26.9,10.16 | C6.1 32.49,15.35 32.15,15.35 26.96,10.16 26.9,10.16 | 26.9,10.16 T1.C
  Top 1.27: 68.58,28.57 70.61,28.57 71.37,29.34 71.37,31.08 | v71.75,44.45 IC1.2 71.75,31.54
  Bottom 0.813: v2.54,55.24 1.27,53.98 1.27,18.41 12.06,7.62 22.23,7.62 25.83,4.01 X2.3 | v48.9,58.42 v51.44,58.42 v53.98,58.42 v56.52,58.42 v59.05,58.42 v61.59,58.42 v64.14,58.42 v66.67,58.42 68.58,58.42 71.75,55.24 v71.75,44.45
  pour Top (no thermals): 31.75,17.53 33.66,17.53 33.66,15.24 31.75,15.24
VPIN  (via drill 0.35)
  Top 0.406: IC4.31 24.26,46.23 v24.77,45.72 | v58.42,23.5 R6.2
  Top 0.61: R2.1 R6.2
  Bottom 0.406: v24.77,45.72 32.38,38.1 53.98,38.1 58.42,33.66 v58.42,23.5
VSYS
  Top 0.813: Q1.2 3.94,51.17 IC4.39

### Text on the board
tPlace: SPARE1 | SPARE2 | GND | RG-11 | 12V | Opened | GND | Closed | GND | Close | Open | GND | AT_PARK | GND | Dome Shutter | GND | +12V | GND | EN | +5V | GND | DIR | +5V | GND | STEP | +5V
bPlace: SPARE1 | SPARE2 | GND | RG-11 | 12V | Opened | GND | Closed | GND | Close | Open | GND | AT_PARK | GND | GND | EN | +5V | GND | DIR | +5V | GND | STEP | +5V